# EAGLE schematic Disco-Cart 2 (EAGLE 9.6.2)

## Sheet 1 of 3
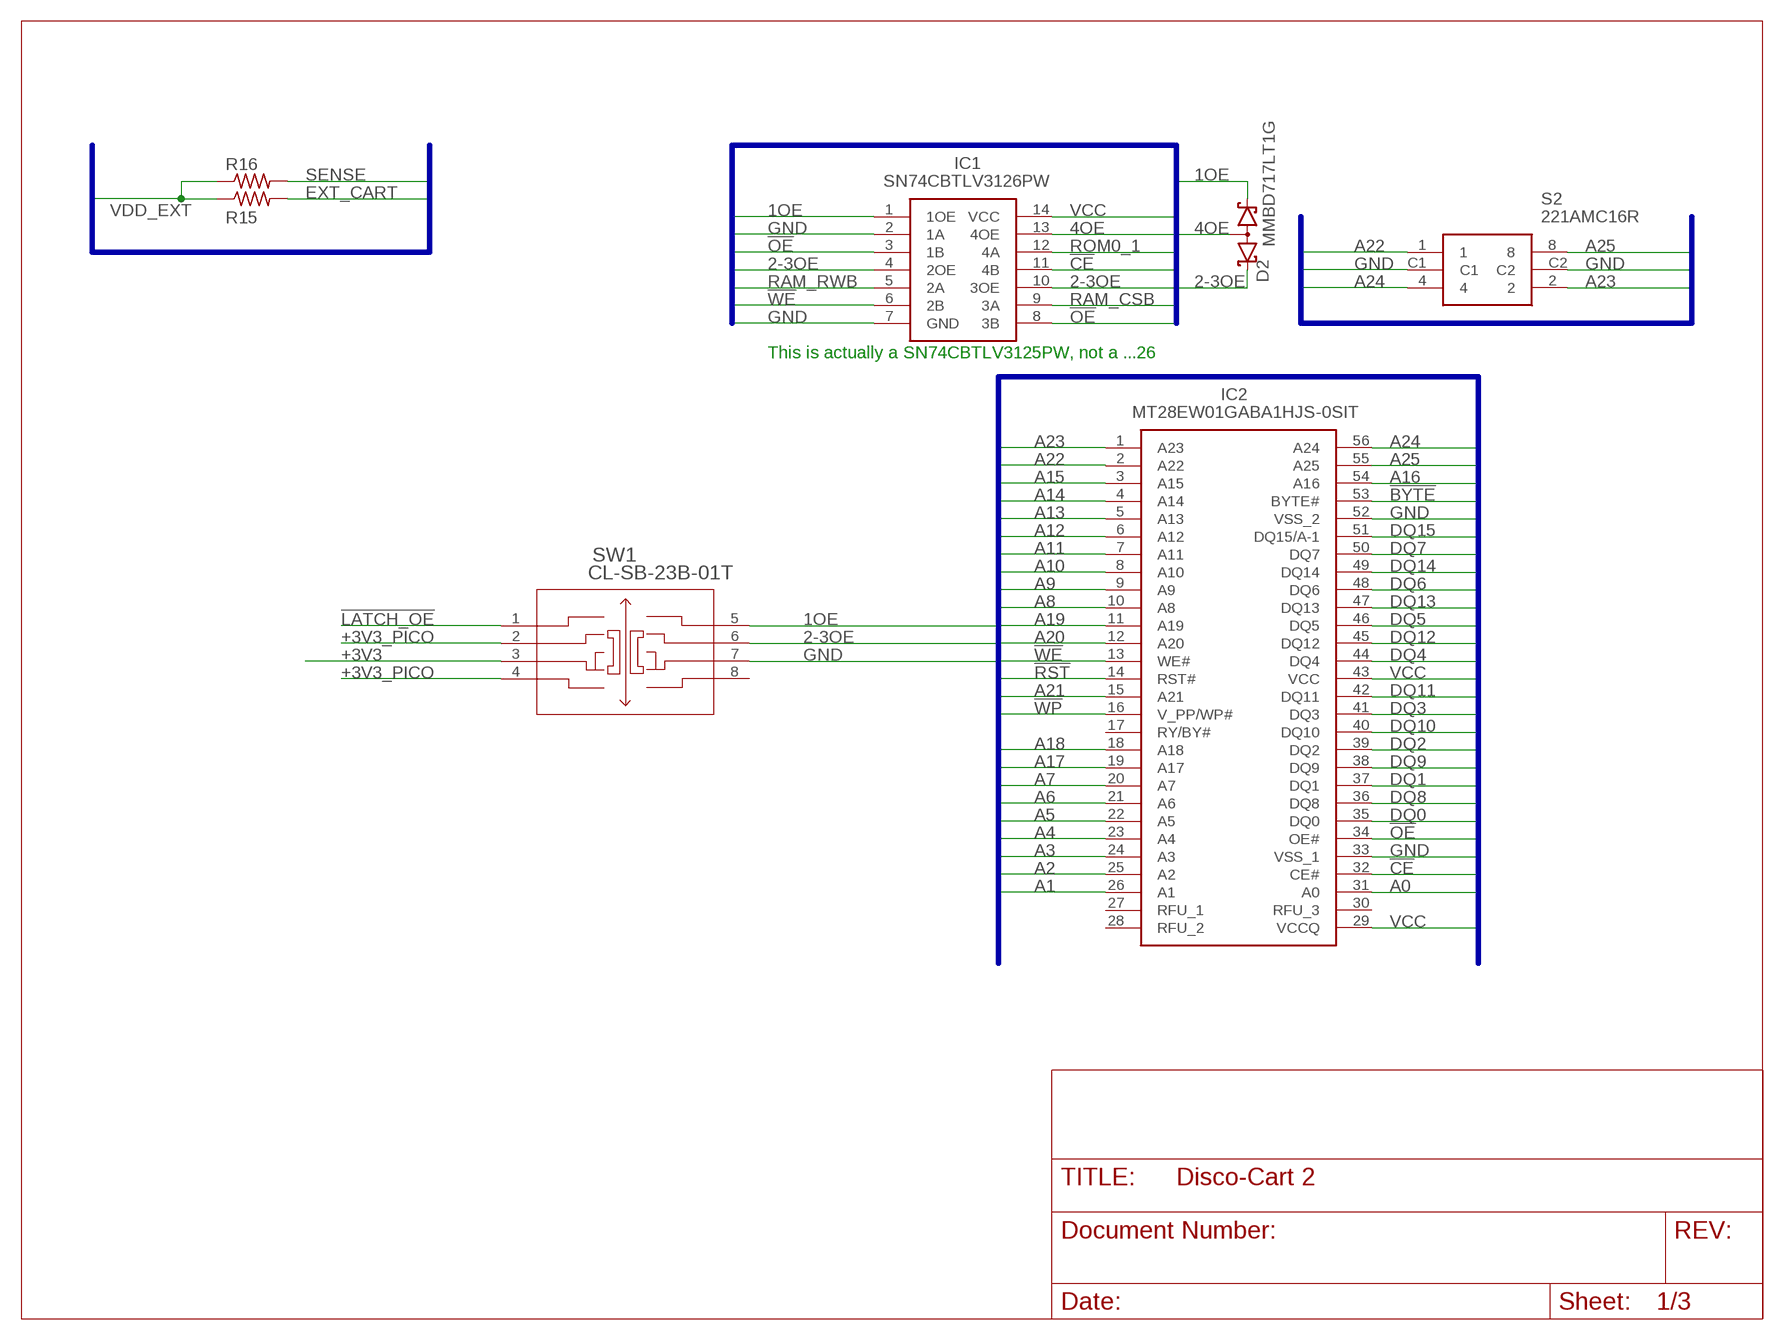
[diagram p0: schematic, sheet 1]

### Parts
D2  MMBD717LT1G  [SOT65P220X100-3N]
IC1  SN74CBTLV3126PW  [SOP65P640X120-14N]
IC2  MT28EW01GABA1HJS-0SIT  [SOP50P2000X120-56N]
R15  R-US_R0603  [R0603]
R16  R-US_R0603  [R0603]
S2  221AMC16R  [221AMC16R]
SW1  CL-SB-23B-01T  [CL-SB-23B_NDC]

### Nets
1OE: D2.1(K2) IC1.1(1OE) SW1.5 ; also sheet 2
2-3OE: D2.2(K1) IC1.4(2OE) IC1.10(3OE) SW1.6 ; also sheet 2
4OE: D2.3(AA) IC1.13(4OE) ; also sheet 2
!BYTE: IC2.53(BYTE#) ; also sheet 2
!CE: IC1.11(4B) IC2.32(CE#) ; also sheet 2
!LATCH_OE: SW1.1 ; also sheet 3
!OE: IC1.3(1B) IC1.8(3B) IC2.34(OE#) ; also sheet 2
!RST: IC2.14(RST#) ; also sheet 2
!WE: IC1.6(2B) IC2.13(WE#) ; also sheet 2
!WP: IC2.16(V_PP/WP#) ; also sheet 2
+3V3: SW1.3 ; also sheet 2,3
+3V3_PICO: SW1.2 SW1.4 ; also sheet 3
A0: IC2.31(A0) ; also sheet 2,3
A1: IC2.26(A1) ; also sheet 2,3
A2: IC2.25(A2) ; also sheet 2,3
A3: IC2.24(A3) ; also sheet 2,3
A4: IC2.23(A4) ; also sheet 2,3
A5: IC2.22(A5) ; also sheet 2,3
A6: IC2.21(A6) ; also sheet 2,3
A7: IC2.20(A7) ; also sheet 2,3
A8: IC2.10(A8) ; also sheet 2,3
A9: IC2.9(A9) ; also sheet 2,3
A10: IC2.8(A10) ; also sheet 2,3
A11: IC2.7(A11) ; also sheet 2,3
A12: IC2.6(A12) ; also sheet 2,3
A13: IC2.5(A13) ; also sheet 2,3
A14: IC2.4(A14) ; also sheet 2,3
A15: IC2.3(A15) ; also sheet 2,3
A16: IC2.54(A16) ; also sheet 2,3
A17: IC2.19(A17) ; also sheet 2,3
A18: IC2.18(A18) ; also sheet 2,3
A19: IC2.11(A19) ; also sheet 2,3
A20: IC2.12(A20) ; also sheet 2,3
A21: IC2.15(A21) ; also sheet 2,3
A22: IC2.2(A22) S2.1 ; also sheet 2
A23: IC2.1(A23) S2.2 ; also sheet 2
A24: IC2.56(A24) S2.4 ; also sheet 2
A25: IC2.55(A25) S2.8 ; also sheet 2
DQ0: IC2.35(DQ0) ; also sheet 2,3
DQ1: IC2.37(DQ1) ; also sheet 2,3
DQ2: IC2.39(DQ2) ; also sheet 2,3
DQ3: IC2.41(DQ3) ; also sheet 2,3
DQ4: IC2.44(DQ4) ; also sheet 2,3
DQ5: IC2.46(DQ5) ; also sheet 2,3
DQ6: IC2.48(DQ6) ; also sheet 2,3
DQ7: IC2.50(DQ7) ; also sheet 2,3
DQ8: IC2.36(DQ8) ; also sheet 2,3
DQ9: IC2.38(DQ9) ; also sheet 2,3
DQ10: IC2.40(DQ10) ; also sheet 2,3
DQ11: IC2.42(DQ11) ; also sheet 2,3
DQ12: IC2.45(DQ12) ; also sheet 2,3
DQ13: IC2.47(DQ13) ; also sheet 2,3
DQ14: IC2.49(DQ14) ; also sheet 2,3
DQ15: IC2.51(DQ15/A-1) ; also sheet 2,3
EXT_CART: R15.2 ; also sheet 2
GND: IC1.2(1A) IC1.7(GND) IC2.33(VSS_1) IC2.52(VSS_2) S2.C1 S2.C2 SW1.7 ; also sheet 2,3
RAM_CSB: IC1.9(3A) ; also sheet 2,3
RAM_RWB: IC1.5(2A) ; also sheet 2,3
ROM0_1: IC1.12(4A) ; also sheet 2,3
SENSE: R16.2 ; also sheet 2
VCC: IC1.14(VCC) IC2.29(VCCQ) IC2.43(VCC) ; also sheet 2
VDD_EXT: R15.1 R16.1 ; also sheet 2
Unconnected: IC2.17(RY/BY#) IC2.27(RFU_1) IC2.28(RFU_2) IC2.30(RFU_3) SW1.8

### Buses
1OE,2-3OE,+3V3,4OE,A[0..25],!BYTE,!CE,DQ[0..15],EXT_CART,GND,!OE,RAM_CSB,RAM_RWB,ROM0_1,ROM_CSB2,!RST,SENSE,VCC,VDD_EXT,!WE,!WP

### Notes on the sheet
- This is actually a SN74CBTLV3125PW, not a ...26

## Sheet 2 of 3
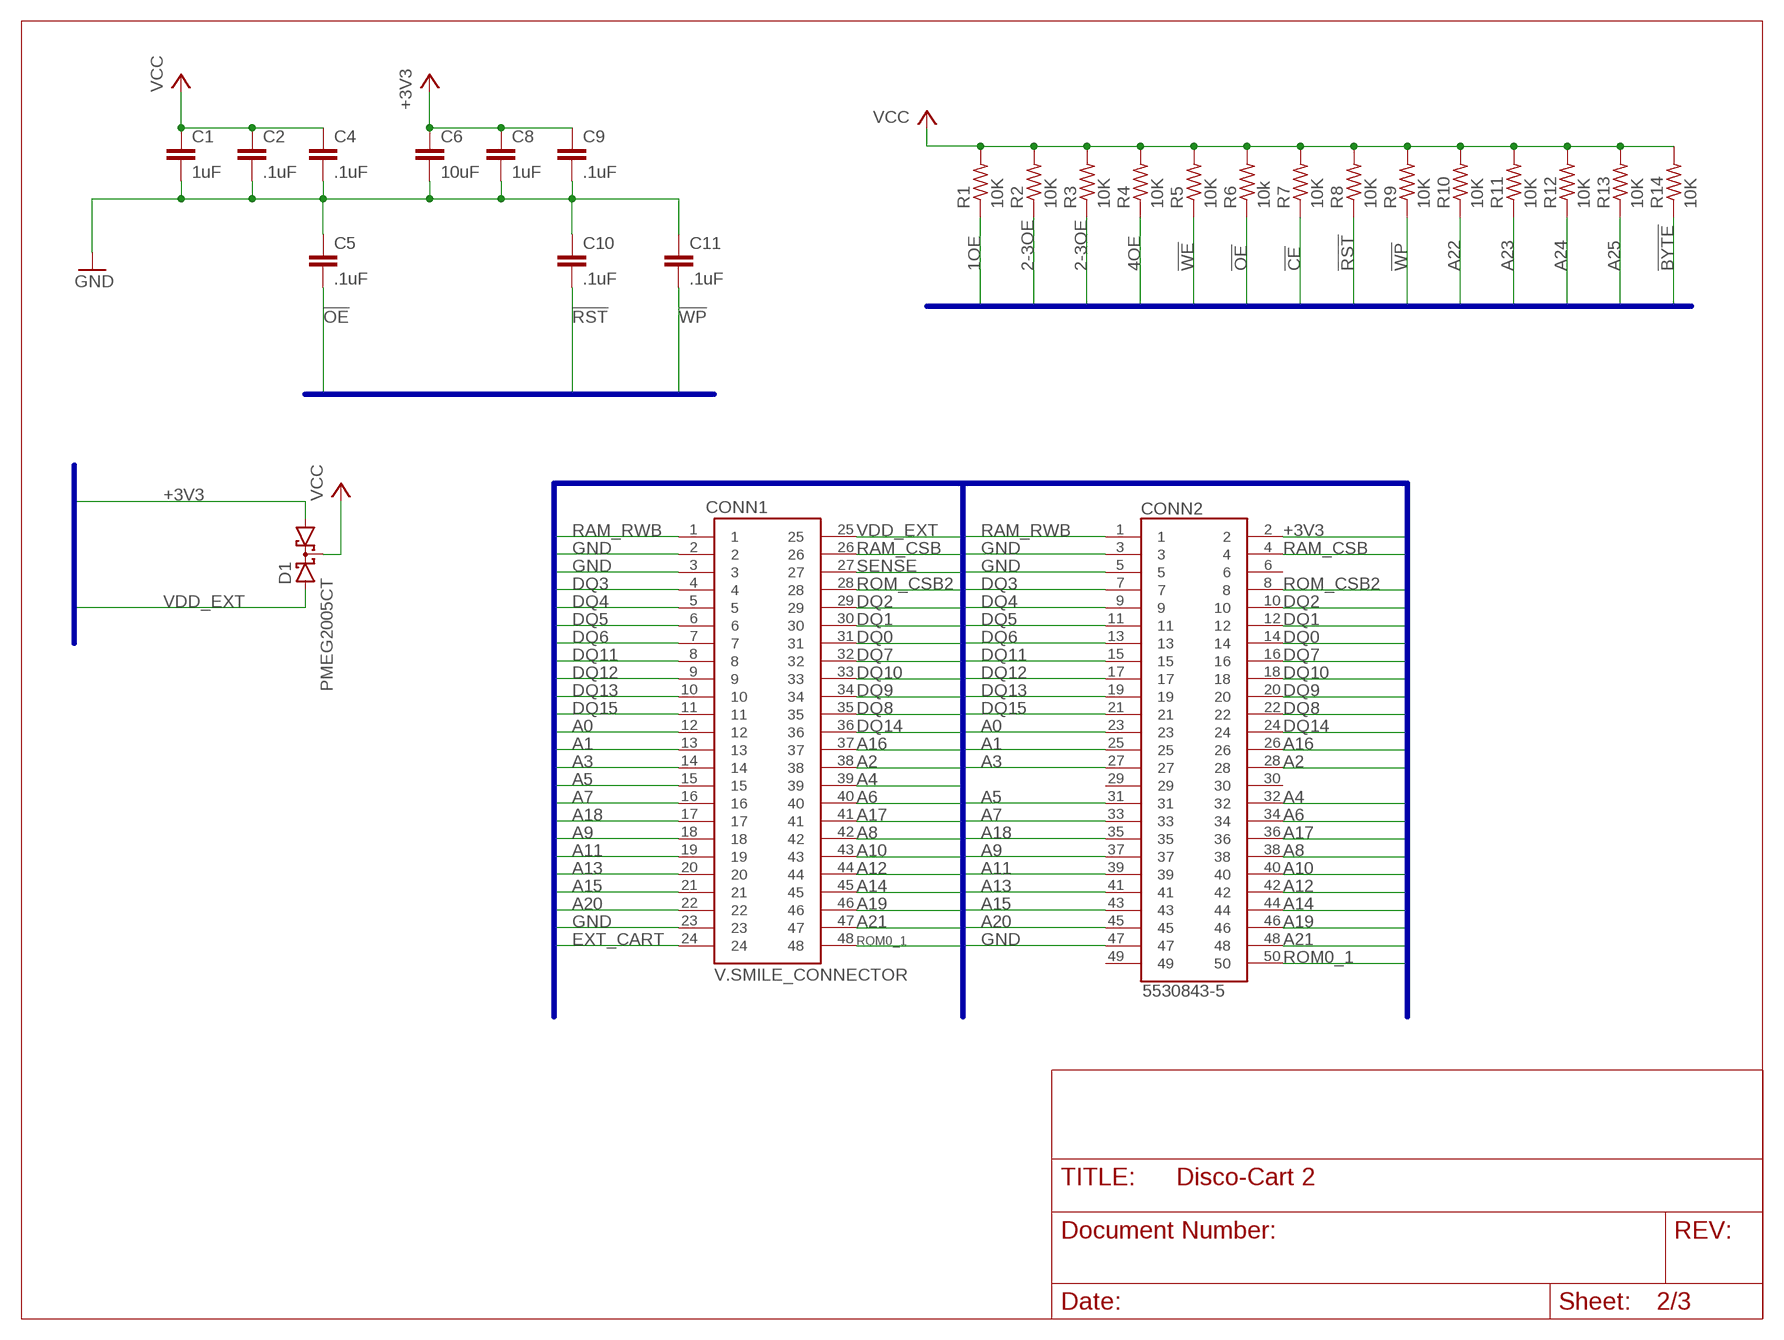
[diagram p1: schematic, sheet 2]

### Parts
C1  1uF  C-EUC0805  [C0805]
C2  .1uF  C-EUC0805  [C0805]
C4  .1uF  C-EUC0805  [C0805]
C5  .1uF  C-EUC0805  [C0805]
C6  10uF  C-EUC0805  [C0805]
C8  1uF  C-EUC0805  [C0805]
C9  .1uF  C-EUC0805  [C0805]
C10  .1uF  C-EUC0805  [C0805]
C11  .1uF  C-EUC0805  [C0805]
CONN1  V.SMILE_CONNECTOR  [V.SMILE_CONNECTOR]
CONN2  5530843-5  [TE_5530843-5]
D1  PMEG2005CT  BAS40-05  [SOT23]
R1  10K  R-US_M0805  [M0805]
R2  10K  R-US_M0805  [M0805]
R3  10K  R-US_M0805  [M0805]
R4  10K  R-US_M0805  [M0805]
R5  10K  R-US_M0805  [M0805]
R6  10k  R-US_M0805  [M0805]
R7  10K  R-US_M0805  [M0805]
R8  10K  R-US_M0805  [M0805]
R9  10K  R-US_M0805  [M0805]
R10  10K  R-US_M0805  [M0805]
R11  10K  R-US_M0805  [M0805]
R12  10K  R-US_M0805  [M0805]
R13  10K  R-US_M0805  [M0805]
R14  10K  R-US_M0805  [M0805]

### Nets
1OE: R1.1 ; also sheet 1
2-3OE: R2.1 R3.1 ; also sheet 1
4OE: R4.1 ; also sheet 1
!BYTE: R14.1 ; also sheet 1
!CE: R7.1 ; also sheet 1
!OE: C5.2 R6.1 ; also sheet 1
!RST: C10.2 R8.1 ; also sheet 1
!WE: R5.1 ; also sheet 1
!WP: C11.2 R9.1 ; also sheet 1
+3V3: C6.1 C8.1 C9.1 CONN2.2 D1.1(A1) ; also sheet 1,3
A0: CONN1.12 CONN2.23 ; also sheet 1,3
A1: CONN1.13 CONN2.25 ; also sheet 1,3
A2: CONN1.38 CONN2.28 ; also sheet 1,3
A3: CONN1.14 CONN2.27 ; also sheet 1,3
A4: CONN1.39 CONN2.32 ; also sheet 1,3
A5: CONN1.15 CONN2.31 ; also sheet 1,3
A6: CONN1.40 CONN2.34 ; also sheet 1,3
A7: CONN1.16 CONN2.33 ; also sheet 1,3
A8: CONN1.42 CONN2.38 ; also sheet 1,3
A9: CONN1.18 CONN2.37 ; also sheet 1,3
A10: CONN1.43 CONN2.40 ; also sheet 1,3
A11: CONN1.19 CONN2.39 ; also sheet 1,3
A12: CONN1.44 CONN2.42 ; also sheet 1,3
A13: CONN1.20 CONN2.41 ; also sheet 1,3
A14: CONN1.45 CONN2.44 ; also sheet 1,3
A15: CONN1.21 CONN2.43 ; also sheet 1,3
A16: CONN1.37 CONN2.26 ; also sheet 1,3
A17: CONN1.41 CONN2.36 ; also sheet 1,3
A18: CONN1.17 CONN2.35 ; also sheet 1,3
A19: CONN1.46 CONN2.46 ; also sheet 1,3
A20: CONN1.22 CONN2.45 ; also sheet 1,3
A21: CONN1.47 CONN2.48 ; also sheet 1,3
A22: R10.1 ; also sheet 1
A23: R11.1 ; also sheet 1
A24: R12.1 ; also sheet 1
A25: R13.1 ; also sheet 1
DQ0: CONN1.31 CONN2.14 ; also sheet 1,3
DQ1: CONN1.30 CONN2.12 ; also sheet 1,3
DQ2: CONN1.29 CONN2.10 ; also sheet 1,3
DQ3: CONN1.4 CONN2.7 ; also sheet 1,3
DQ4: CONN1.5 CONN2.9 ; also sheet 1,3
DQ5: CONN1.6 CONN2.11 ; also sheet 1,3
DQ6: CONN1.7 CONN2.13 ; also sheet 1,3
DQ7: CONN1.32 CONN2.16 ; also sheet 1,3
DQ8: CONN1.35 CONN2.22 ; also sheet 1,3
DQ9: CONN1.34 CONN2.20 ; also sheet 1,3
DQ10: CONN1.33 CONN2.18 ; also sheet 1,3
DQ11: CONN1.8 CONN2.15 ; also sheet 1,3
DQ12: CONN1.9 CONN2.17 ; also sheet 1,3
DQ13: CONN1.10 CONN2.19 ; also sheet 1,3
DQ14: CONN1.36 CONN2.24 ; also sheet 1,3
DQ15: CONN1.11 CONN2.21 ; also sheet 1,3
EXT_CART: CONN1.24 ; also sheet 1
GND: C1.2 C2.2 C4.2 C5.1 C6.2 C8.2 C9.2 C10.1 C11.1 CONN1.2 CONN1.3 CONN1.23 CONN2.3 CONN2.5 CONN2.47 ; also sheet 1,3
RAM_CSB: CONN1.26 CONN2.4 ; also sheet 1,3
RAM_RWB: CONN1.1 CONN2.1 ; also sheet 1,3
ROM0_1: CONN1.48 CONN2.50 ; also sheet 1,3
ROM_CSB2: CONN1.28 CONN2.8 ; also sheet 3
SENSE: CONN1.27 ; also sheet 1
VCC: C1.1 C2.1 C4.1 D1.3(C) R1.2 R2.2 R3.2 R4.2 R5.2 R6.2 R7.2 R8.2 R9.2 R10.2 R11.2 R12.2 R13.2 R14.2 ; also sheet 1
VDD_EXT: CONN1.25 D1.2(A2) ; also sheet 1
Unconnected: CONN2.6 CONN2.29 CONN2.30 CONN2.49

### Buses
1OE,2-3OE,3OE,+3V3,4OE,A[0..25],!BYTE,!CE,DQ[0..15],EXT_CART,GND,!OE,RAM_CSB,RAM_RWB,ROM0_1,ROM_CSB2,!RST,SENSE,VCC,VDD_EXT,!WE,!WP

## Sheet 3 of 3
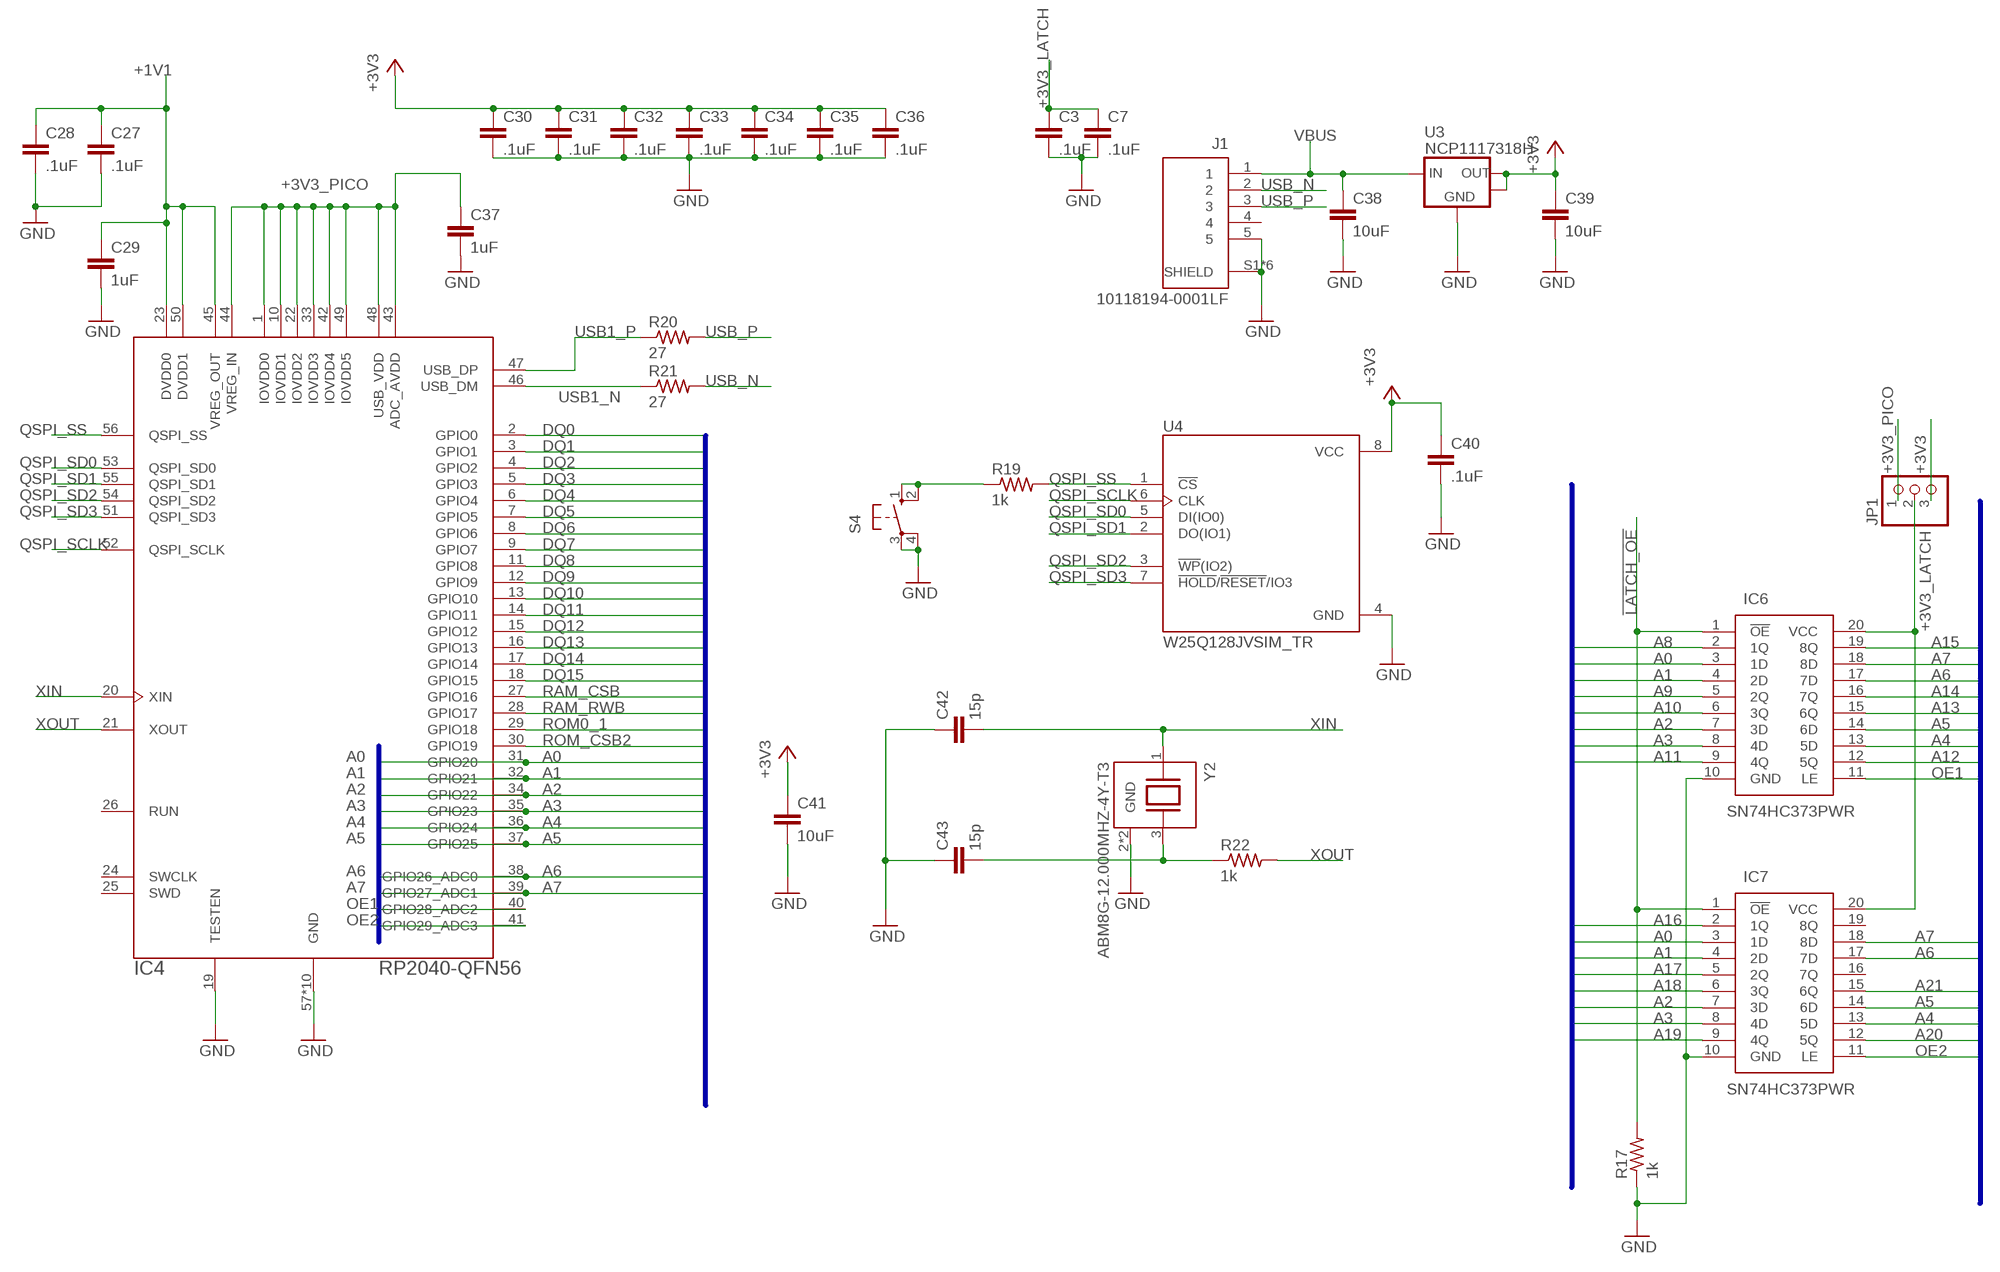
[diagram p2: schematic, sheet 3]

### Parts
C3  .1uF  C-EUC0402  [C0402]
C7  .1uF  C-EUC0402  [C0402]
C27  .1uF  C-EUC0402  [C0402]
C28  .1uF  C-EUC0402  [C0402]
C29  1uF  C-EUC0402  [C0402]
C30  .1uF  C-EUC0402  [C0402]
C31  .1uF  C-EUC0402  [C0402]
C32  .1uF  C-EUC0402  [C0402]
C33  .1uF  C-EUC0402  [C0402]
C34  .1uF  C-EUC0402  [C0402]
C35  .1uF  C-EUC0402  [C0402]
C36  .1uF  C-EUC0402  [C0402]
C37  1uF  C-EUC0402  [C0402]
C38  10uF  C-EUC0805  [C0805]
C39  10uF  C-EUC0805  [C0805]
C40  .1uF  C-EUC0402  [C0402]
C41  10uF  C-EUC0805  [C0805]
C42  15p  C-EUC0402  [C0402]
C43  15p  C-EUC0402  [C0402]
IC4  RP2040-QFN56  [RP2040-QFN-56]
IC6  SN74HC373PWR  [SOP65P640X120-20N]
IC7  SN74HC373PWR  [SOP65P640X120-20N]
J1  10118194-0001LF  [AMPHENOL_10118194-0001LF]
JP1  PINHD-1X3  [1X03]
R17  1k  R-US_R0805  [R0805]
R19  1k  R-US_R0402  [R0402]
R20  27  R-US_R0402  [R0402]
R21  27  R-US_R0402  [R0402]
R22  1k  R-US_R0402  [R0402]
S4  10-XX  [B3F-10XX]
U3  NCP1117318H  [SOT223]
U4  W25Q128JVSIM_TR  [SOIC127P790X216-8N]
Y2  ABM8G-12.000MHZ-4Y-T3  [XTAL_ABM8G-12.000MHZ-4Y-T3]

### Nets
!LATCH_OE: IC6.1(!OE) IC7.1(!OE) R17.2 ; also sheet 1
+1V1: C27.1 C28.1 C29.1 IC4.23(DVDD0) IC4.45(VREG_OUT) IC4.50(DVDD1)
+3V3: C30.1 C31.1 C32.1 C33.1 C34.1 C35.1 C36.1 C39.1 C40.1 C41.1 JP1.3 U3.2(OUT) U3.TAB(OUT) U4.8(VCC) ; also sheet 1,2
+3V3_LATCH: C3.1 C7.1 IC6.20(VCC) IC7.20(VCC) JP1.2
+3V3_PICO: C37.1 IC4.1(IOVDD0) IC4.10(IOVDD1) IC4.22(IOVDD2) IC4.33(IOVDD3) IC4.42(IOVDD4) IC4.43(ADC_AVDD) IC4.44(VREG_IN) IC4.48(USB_VDD) IC4.49(IOVDD5) JP1.1 ; also sheet 1
A0: IC4.31(GPIO20) IC6.3(1D) IC7.3(1D) ; also sheet 1,2
A1: IC4.32(GPIO21) IC6.4(2D) IC7.4(2D) ; also sheet 1,2
A2: IC4.34(GPIO22) IC6.7(3D) IC7.7(3D) ; also sheet 1,2
A3: IC4.35(GPIO23) IC6.8(4D) IC7.8(4D) ; also sheet 1,2
A4: IC4.36(GPIO24) IC6.13(5D) IC7.13(5D) ; also sheet 1,2
A5: IC4.37(GPIO25) IC6.14(6D) IC7.14(6D) ; also sheet 1,2
A6: IC4.38(GPIO26_ADC0) IC6.17(7D) IC7.17(7D) ; also sheet 1,2
A7: IC4.39(GPIO27_ADC1) IC6.18(8D) IC7.18(8D) ; also sheet 1,2
A8: IC6.2(1Q) ; also sheet 1,2
A9: IC6.5(2Q) ; also sheet 1,2
A10: IC6.6(3Q) ; also sheet 1,2
A11: IC6.9(4Q) ; also sheet 1,2
A12: IC6.12(5Q) ; also sheet 1,2
A13: IC6.15(6Q) ; also sheet 1,2
A14: IC6.16(7Q) ; also sheet 1,2
A15: IC6.19(8Q) ; also sheet 1,2
A16: IC7.2(1Q) ; also sheet 1,2
A17: IC7.5(2Q) ; also sheet 1,2
A18: IC7.6(3Q) ; also sheet 1,2
A19: IC7.9(4Q) ; also sheet 1,2
A20: IC7.12(5Q) ; also sheet 1,2
A21: IC7.15(6Q) ; also sheet 1,2
DQ0: IC4.2(GPIO0) ; also sheet 1,2
DQ1: IC4.3(GPIO1) ; also sheet 1,2
DQ2: IC4.4(GPIO2) ; also sheet 1,2
DQ3: IC4.5(GPIO3) ; also sheet 1,2
DQ4: IC4.6(GPIO4) ; also sheet 1,2
DQ5: IC4.7(GPIO5) ; also sheet 1,2
DQ6: IC4.8(GPIO6) ; also sheet 1,2
DQ7: IC4.9(GPIO7) ; also sheet 1,2
DQ8: IC4.11(GPIO8) ; also sheet 1,2
DQ9: IC4.12(GPIO9) ; also sheet 1,2
DQ10: IC4.13(GPIO10) ; also sheet 1,2
DQ11: IC4.14(GPIO11) ; also sheet 1,2
DQ12: IC4.15(GPIO12) ; also sheet 1,2
DQ13: IC4.16(GPIO13) ; also sheet 1,2
DQ14: IC4.17(GPIO14) ; also sheet 1,2
DQ15: IC4.18(GPIO15) ; also sheet 1,2
GND: C3.2 C7.2 C27.2 C28.2 C29.2 C30.2 C31.2 C32.2 C33.2 C34.2 C35.2 C36.2 C37.2 C38.2 C39.2 C40.2 C41.2 C42.1 C43.1 IC4.19(TESTEN) IC4.57(GND) IC4.58(GND) IC4.59(GND) IC4.60(GND) IC4.61(GND) IC4.62(GND) IC4.63(GND) IC4.64(GND) IC4.65(GND) IC4.66(GND) IC6.10(GND) IC7.10(GND) J1.5 J1.S1(SHIELD) J1.S2(SHIELD) J1.S3(SHIELD) J1.S4(SHIELD) J1.S5(SHIELD) J1.S6(SHIELD) R17.1 S4.3(P) S4.4(P1) U3.1(GND) U4.4(GND) Y2.2(GND) Y2.4(GND) ; also sheet 1,2
N$1: R19.1 S4.1(S) S4.2(S1)
OE1: IC4.40(GPIO28_ADC2) IC6.11(LE)
OE2: IC4.41(GPIO29_ADC3) IC7.11(LE)
QSPI_SCLK: IC4.52(QSPI_SCLK) U4.6(CLK)
QSPI_SD0: IC4.53(QSPI_SD0) U4.5(DI(IO0))
QSPI_SD1: IC4.55(QSPI_SD1) U4.2(DO(IO1))
QSPI_SD2: IC4.54(QSPI_SD2) U4.3(!WP!(IO2))
QSPI_SD3: IC4.51(QSPI_SD3) U4.7(!HOLD!/!RESET!/IO3)
QSPI_SS: IC4.56(QSPI_SS) R19.2 U4.1(!CS)
RAM_CSB: IC4.27(GPIO16) ; also sheet 1,2
RAM_RWB: IC4.28(GPIO17) ; also sheet 1,2
ROM0_1: IC4.29(GPIO18) ; also sheet 1,2
ROM_CSB2: IC4.30(GPIO19) ; also sheet 2
USB1_N: IC4.46(USB_DM) R21.1
USB1_P: IC4.47(USB_DP) R20.1
USB_N [USB]: J1.2 R21.2
USB_P [USB]: J1.3 R20.2
VBUS: C38.1 J1.1 U3.3(IN)
XIN: C42.2 IC4.20(XIN) Y2.1
XOUT: IC4.21(XOUT) R22.2
XOUT2: C43.2 R22.1 Y2.3
Unconnected: IC4.24(SWCLK) IC4.25(SWD) IC4.26(RUN) IC7.16(7Q) IC7.19(8Q) J1.4

### Buses
1OE,2-3OE,3OE,+3V3,4OE,A[0..25],!BYTE,!CE,DQ[0..15],EXT_CART,GND,!OE,OE[1..2],RAM_CSB,RAM_RWB,ROM0_1,ROM_CSB2,!RST,SENSE,VCC,VDD_EXT,!WE,!WP
A[0..21],OE[1..2]

## Library data of the parts
C1-C11 C27-C43 = rcl:C-EU: CAPACITOR, European symbol; SPICEPREFIX: C
CONN1 = RetroSpy_Technologies:V.SMILE_CONNECTOR
CONN2 = 5530843-5:5530843-5: CONN CARDEDGE FEMALE 50POS 0.100; MANUFACTURER: TE Connectivity; PARTREV: F8; STANDARD: Manufacturer Recommendations
D1 = diode:BAS40-05: Silicon Schottky Diodes General-purpose diode for high-speed switching
D2 = MMBD717LT1G:MMBD717LT1G: ON SEMICONDUCTOR - MMBD717LT1G - DIODE, SCHOTTKY, 20V, SC-70 Source: Datasheet <http://www.onsemi.com/pub/Collateral/MMBD717LT1-D.PDF>; DESCRIPTION: ON SEMICONDUCTOR - MMBD717LT1G - DIODE, SCHOTTKY, 20V, SC-70; HEIGHT: 1mm; MANUFACTURER_NAME: onsemi; MANUFACTURER_PART_NUMBER: MMBD717LT1G; MOUSER_PART_NUMBER: 863-MMBD717LT1G; MOUSER_PRICE-STOCK: https://www.mouser.co.uk/ProductDetail/onsemi/MMBD717LT1G?qs=HVbQlW5zcXXoI1xmb8CO%2Fg%3D%3D
IC1 = SN74CBTLV3126PW:SN74CBTLV3126PW: Texas Instruments SN74CBTLV3126PW, Bus Switch, 1 x 1:1, 2.3 3.6 V, 14-Pin TSSOP Source: Datasheet <http://www.ti.com/lit/gpn/SN74CBTLV3126>; DESCRIPTION: Texas Instruments SN74CBTLV3126PW, Bus Switch, 1 x 1:1, 2.3 3.6 V, 14-Pin TSSOP; HEIGHT: 1.2mm; MANUFACTURER_NAME: Texas Instruments; MANUFACTURER_PART_NUMBER: SN74CBTLV3126PW; MOUSER_PART_NUMBER: 595-SN74CBTLV3126PW; MOUSER_PRICE-STOCK: https://www.mouser.co.uk/ProductDetail/Texas-Instruments/SN74CBTLV3126PW?qs=mE33ZKBHyE6FyZzkaaziWg%3D%3D
IC2 = MT28EW01GABA1HJS-0SIT:MT28EW01GABA1HJS-0SIT: NOR Flash Parallel NOR Flash MT28EW01GABA1HJS 0SIT Source: Datasheet <https://datasheet.datasheetarchive.com/originals/distributors/DKDS-40/46646.pdf>; DESCRIPTION: NOR Flash Parallel NOR Flash MT28EW01GABA1HJS 0SIT; HEIGHT: 1.2mm; MANUFACTURER_NAME: Micron; MANUFACTURER_PART_NUMBER: MT28EW01GABA1HJS-0SIT; MOUSER_PART_NUMBER: 340-278002-TRAY; MOUSER_PRICE-STOCK: https://www.mouser.co.uk/ProductDetail/Micron/MT28EW01GABA1HJS-0SIT?qs=rrS6PyfT74epx%252B6A5jTP8w%3D%3D
IC4 = RpiPico:RP2040-QFN56
IC6 IC7 = SN74HC373PWR:SN74HC373PWR: Octal Transparent D-Type Latches With 3-State Outputs Source: Datasheet <http://www.ti.com/lit/gpn/sn74hc373>; DESCRIPTION: Octal Transparent D-Type Latches With 3-State Outputs; HEIGHT: 1.2mm; MANUFACTURER_NAME: Texas Instruments; MANUFACTURER_PART_NUMBER: SN74HC373PWR; MOUSER_PART_NUMBER: 595-SN74HC373PWR; MOUSER_PRICE-STOCK: https://www.mouser.co.uk/ProductDetail/Texas-Instruments/SN74HC373PWR?qs=EIjG%252BN7kn%252BltZC%2F8eHCguw%3D%3D
J1 = 10118194-0001LF:10118194-0001LF; MANUFACTURER: Amphenol ICC; MAXIMUM_PACKAGE_HEIGHT: 2.66 mm; PARTREV: D; STANDARD: Manufacturer Recommendations
JP1 = adafruit:PINHD-1X3: PIN HEADER
R1-R17 R19-R22 = rcl:R-US_: RESISTOR, American symbol; SPICEPREFIX: R
S2 = 221AMC16R:221AMC16R: 16 Way Surface Mount DIP Switch SPST Source: Datasheet <https://componentsearchengine.com/Datasheets/1/221AMC16R.pdf>; DESCRIPTION: 16 Way Surface Mount DIP Switch SPST; HEIGHT: 6.02mm; MANUFACTURER_NAME: CTS; MANUFACTURER_PART_NUMBER: 221AMC16R; MOUSER_PART_NUMBER: 774-221AMC16R; MOUSER_PRICE-STOCK: https://www.mouser.com/Search/Refine.aspx?Keyword=774-221AMC16R
S4 = switch-omron:10-XX: OMRON SWITCH; MPN: B3F-1000; OC_FARNELL: 176432; OC_NEWARK: 36M3542
SW1 = CL-SB-23B-01T:CL-SB-23B-01T; COPYRIGHT: Copyright (C) 2024 Ultra Librarian. All rights reserved.; MANUFACTURER_PART_NUMBER: CL-SB-23B-01T; MFR_NAME: Nidec Copal Electronics
U3 = NCP1117:NCP1117: NCP1117 LDO Positive Voltage Regulator Check availability <https://pricing.snapeda.com/parts/NCP1117/ON%20Semiconductor/view-part?ref=eda>; AVAILABILITY: In Stock; CHECK_PRICES: https://www.snapeda.com/parts/NCP1117/Onsemi/view-part/?ref=eda; DESCRIPTION: Linear Voltage Regulator IC Positive Fixed 1 Output 1A SOT-223; MF: ON Semiconductor; MP: NCP1117; PACKAGE: None; PRICE: None; SNAPEDA_LINK: https://www.snapeda.com/parts/NCP1117/Onsemi/view-part/?ref=snap
U4 = W25Q128JVSIM_TR:W25Q128JVSIM_TR; CHECK_PRICES: https://www.snapeda.com/parts/W25Q128JVSIM%20TR/Winbond+Electronics/view-part/?ref=eda; DESCRIPTION: FLASH - NOR Memory IC 128Mb (16M x 8) SPI - Quad I/O, QPI, DTR 133 MHz 8-SOIC; DIGIKEY_PART_NUMBER: W25Q128JVSIMTR-ND; MF: Winbond Electronics; MP: W25Q128JVSIM TR; PACKAGE: SOIC-8 Winbond Electronics; PURCHASE-URL: https://www.snapeda.com/api/url_track_click_mouser/?unipart_id=1598729&manufacturer=Winbond Electronics&part_name=W25Q128JVSIM TR&search_term=w25q128jvs; SNAPEDA_LINK: https://www.snapeda.com/parts/W25Q128JVSIM%20TR/Winbond+Electronics/view-part/?ref=snap
Y2 = ABM8G-12.000MHZ-4Y-T3:ABM8G-12.000MHZ-4Y-T3; MANUFACTURER: Abracon; MAXIMUM_PACKAGE_HEIGHT: 1.0 mm; PARTREV: 08.13.15; STANDARD: Manufacturer Recommendations

## Net classes
1 USB: width 0.406 mm